# Altium project StepMotor_TMC5160.PrjPcb
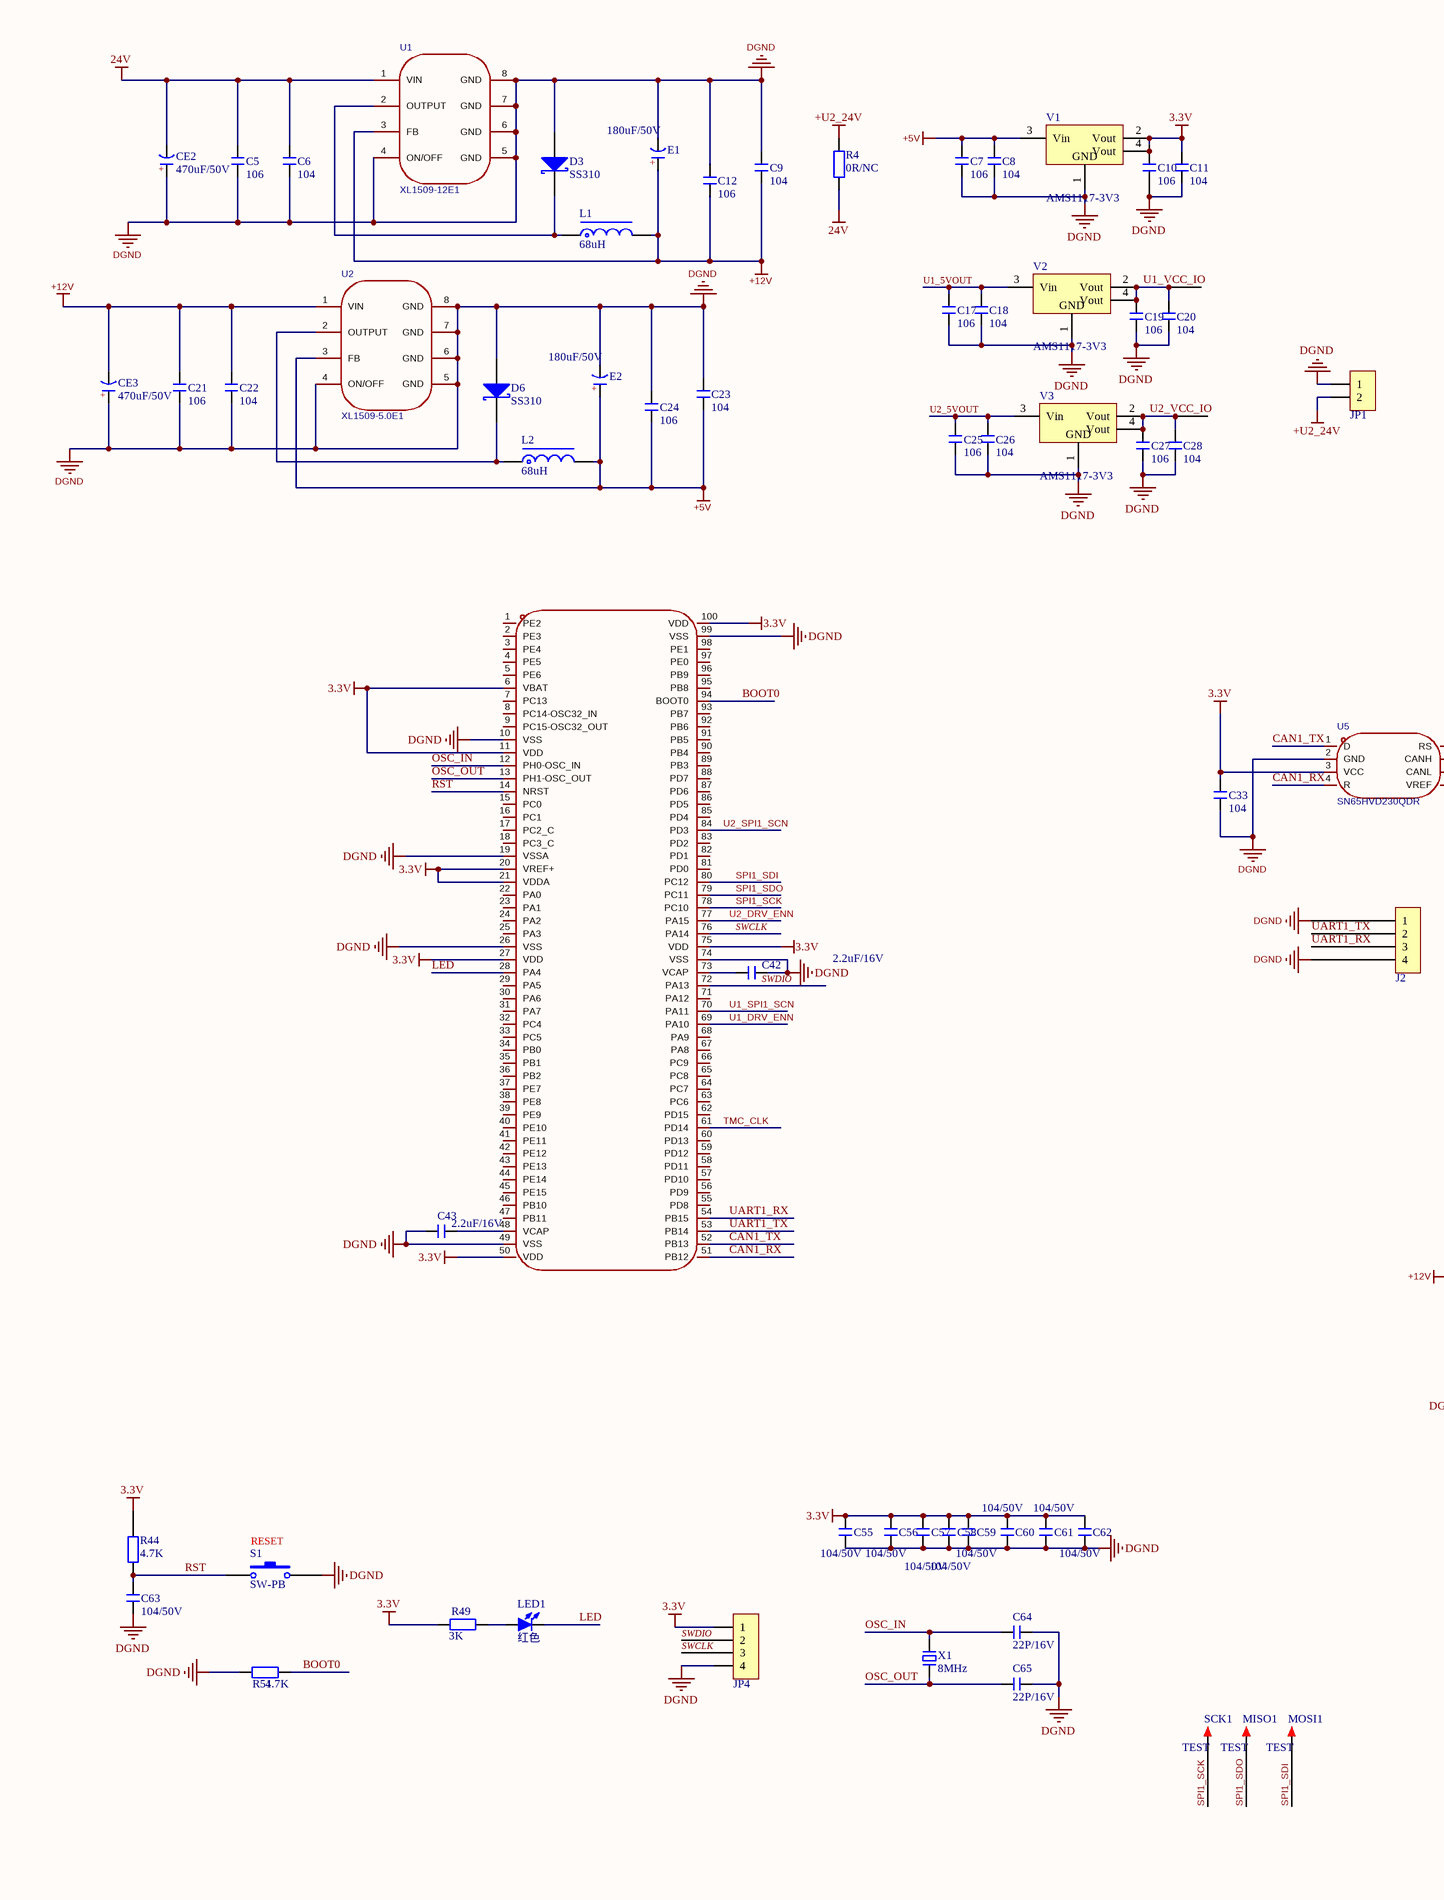
[diagram p0: StepTMC5160.SchDoc, left]
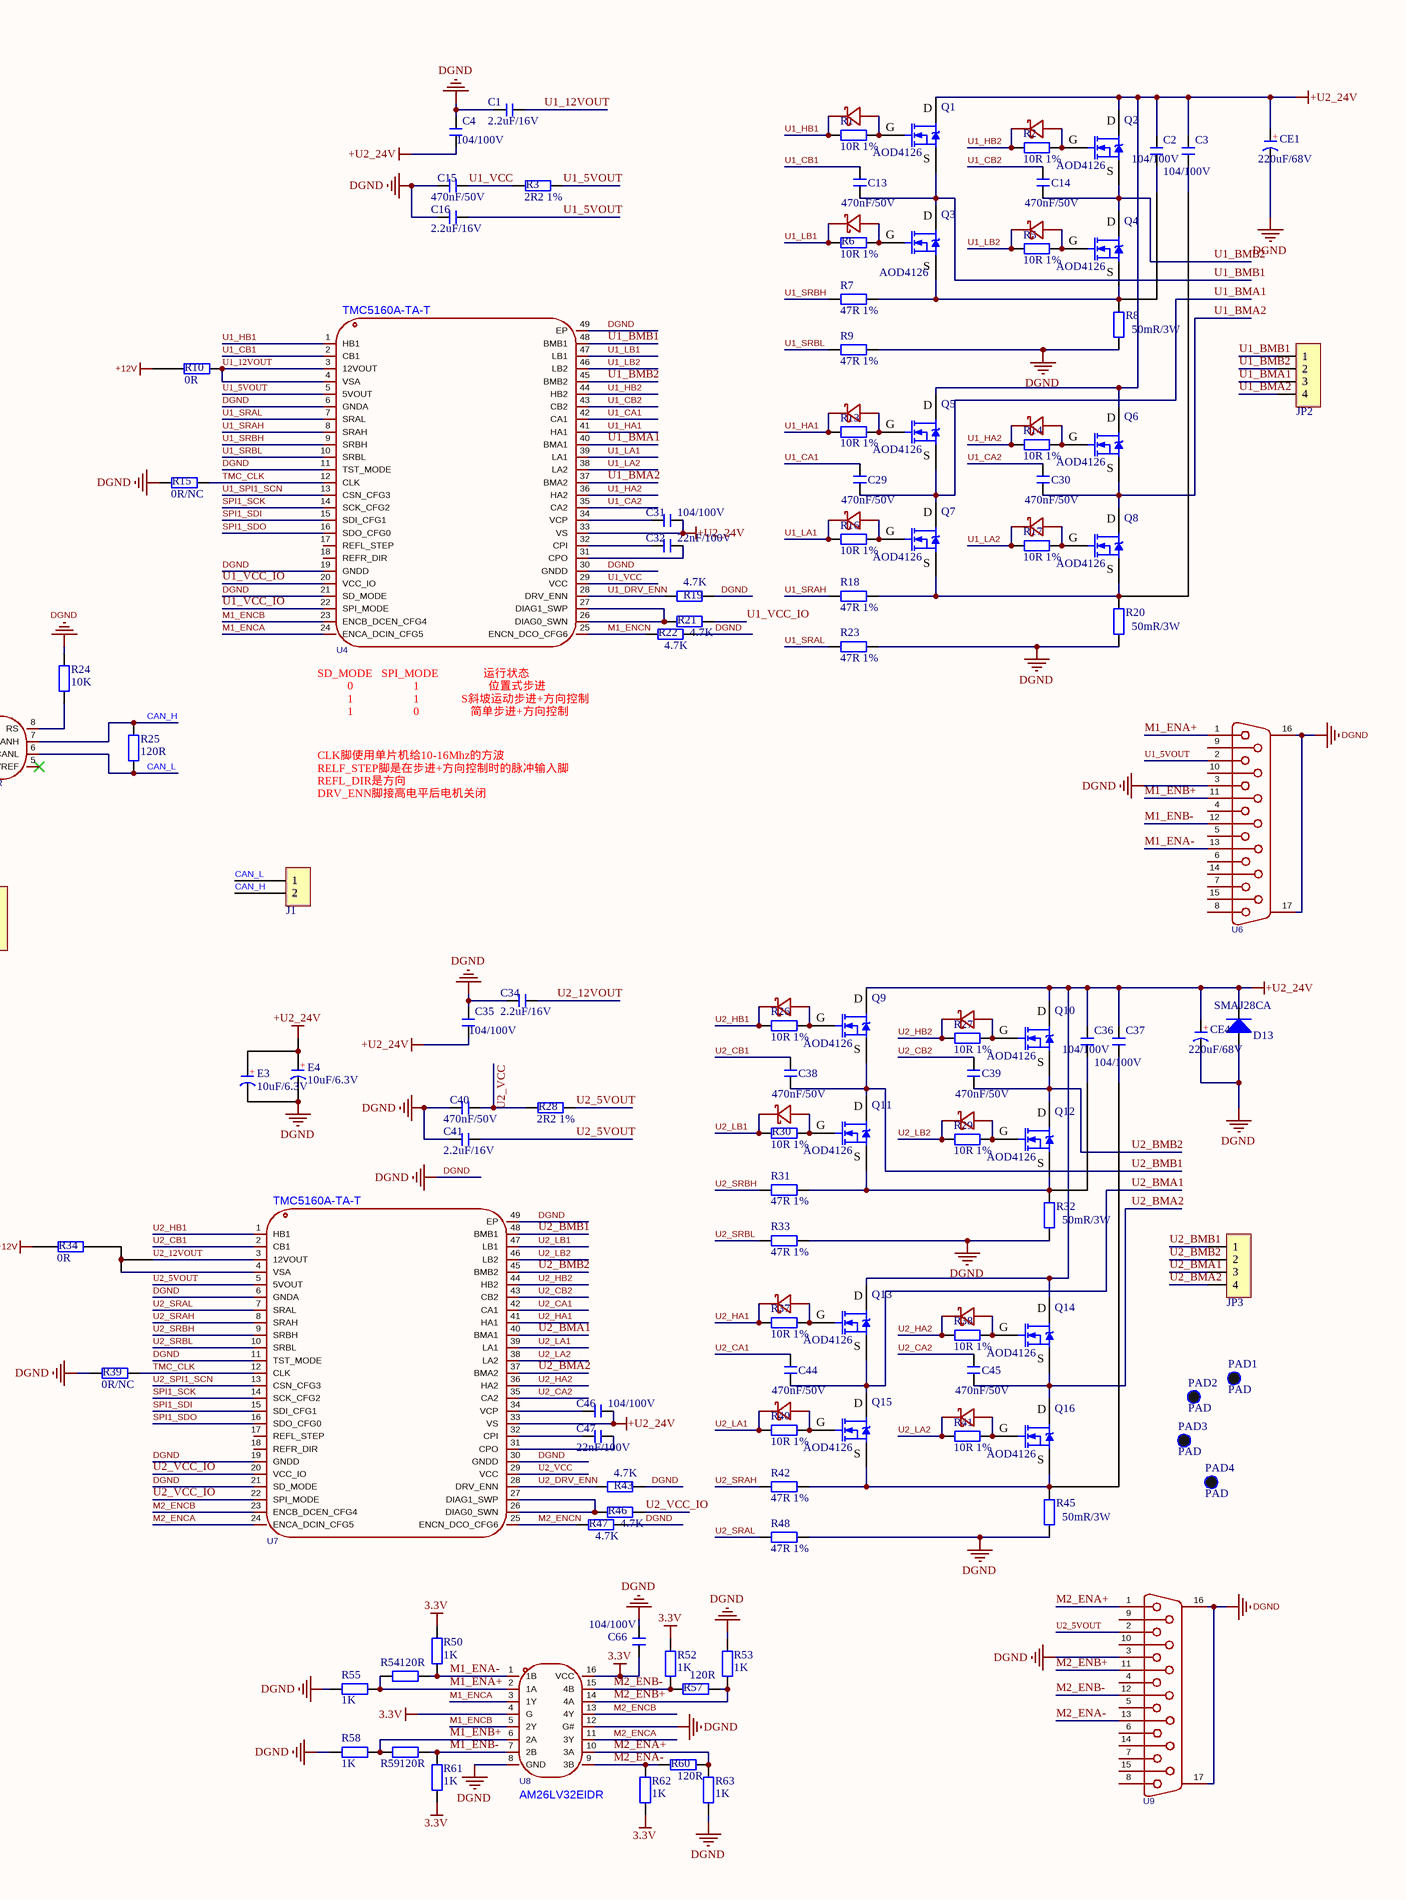
[diagram p1: StepTMC5160.SchDoc, right]
1 sheet, 190 parts. Net scope: global (net labels, ports and power ports of the same name join across sheets).
Board file: StepTMC5160.PcbDoc

## Sheet StepTMC5160.SchDoc
size A2; SheetNumber: 1; SheetTotal: 1

### Parts
C1  2.2uF/16V  [C 0603_L]
C2  104/100V  [C 0805_L]
C3  104/100V  [C 0805_L]
C4  104/100V  [C 0805_L]
C5  106  [C 0805_M]
C6  104  [C 0603_M]
C7  106  [C 0805_M]
C8  104  [C 0603_M]
C9  104  [C 0603_M]
C10  106  [C 0805_M]
C11  104  [C 0603_M]
C12  106  [C 0805_M]
C13  470nF/50V  [C 0805_L]
C14  470nF/50V  [C 0805_L]
C15  470nF/50V  [C 0603_L]
C16  2.2uF/16V  [C 0603_L]
C17  106  [C 0805_M]
C18  104  [C 0603_M]
C19  106  [C 0805_M]
C20  104  [C 0603_M]
C21  106  [C 0805_M]
C22  104  [C 0603_M]
C23  104  [C 0603_M]
C24  106  [C 0805_M]
C25  106  [C 0805_M]
C26  104  [C 0603_M]
C27  106  [C 0805_M]
C28  104  [C 0603_M]
C29  470nF/50V  [C 0805_L]
C30  470nF/50V  [C 0805_L]
C31  104/100V  [C 0805_L]
C32  22nF/100V  [C 0603_L]
C33  104  [C 0603_L]
C34  2.2uF/16V  [C 0603_L]
C35  104/100V  [C 0805_L]
C36  104/100V  [C 0805_L]
C37  104/100V  [C 0805_L]
C38  470nF/50V  [C 0805_L]
C39  470nF/50V  [C 0805_L]
C40  470nF/50V  [C 0603_L]
C41  2.2uF/16V  [C 0603_L]
C42  2.2uF/16V  [C 0603_L]
C43  2.2uF/16V  [C 0603_L]
C44  470nF/50V  [C 0805_L]
C45  470nF/50V  [C 0805_L]
C46  104/100V  [C 0805_L]
C47  22nF/100V  [C 0603_L]
C55  104/50V  [C 0603_L]
C56  104/50V  [C 0603_L]
C57  104/50V  [C 0603_L]
C58  104/50V  [C 0603_L]
C59  104/50V  [C 0603_L]
C60  104/50V  [C 0603_L]
C61  104/50V  [C 0603_L]
C62  104/50V  [C 0603_L]
C63  104/50V  [C 0603_L]
C64  22P/16V  [C 0603_M]
C65  22P/16V  [C 0603_M]
C66  104/100V  [C 0805_L]
CE1  220uF/68V  [CAP 5.0*10*12.5 - BK]
CE2  470uF/50V  [CAP 5.0*10*20]
CE3  470uF/50V  [CAP 5.0*10*20]
CE4  220uF/68V  [CAP 5.0*10*12.5 - BK]
D1  1N4148W_C7420318  [SOD-123]  (value not drawn)
D2  1N4148W_C7420318  [SOD-123]  (value not drawn)
D3  SS310  [SMA]
D4  1N4148W_C7420318  [SOD-123]  (value not drawn)
D5  1N4148W_C7420318  [SOD-123]  (value not drawn)
D6  SS310  [SMA]
D7  1N4148W_C7420318  [SOD-123]  (value not drawn)
D8  1N4148W_C7420318  [SOD-123]  (value not drawn)
D9  1N4148W_C7420318  [SOD-123]  (value not drawn)
D10  1N4148W_C7420318  [SOD-123]  (value not drawn)
D11  1N4148W_C7420318  [SOD-123]  (value not drawn)
D12  1N4148W_C7420318  [SOD-123]  (value not drawn)
D13  SMAJ28CA  [DIODE-SMB]
D14  1N4148W_C7420318  [SOD-123]  (value not drawn)
D15  1N4148W_C7420318  [SOD-123]  (value not drawn)
D16  1N4148W_C7420318  [SOD-123]  (value not drawn)
D17  1N4148W_C7420318  [SOD-123]  (value not drawn)
D18  1N4148W_C7420318  [SOD-123]  (value not drawn)
D19  1N4148W_C7420318  [SOD-123]  (value not drawn)
E1  180uF/50V  [CM E(8*10.2)]
E2  180uF/50V  [CM E(8*10.2)]
E3  10uF/6.3V  [CD A(3216)]
E4  10uF/6.3V  [CD A(3216)]
J1  HDR-1X2  [XH2.54-LI-2P]  (value not drawn)
J2  HDR-1X4  [HDR2.54-LI-4P]  (value not drawn)
JP1  HDR-1X2  [VH3.96-LI-2P]  (value not drawn)
JP2  HDR-1X4  [KF2EDGK5.0-LI-4P]  (value not drawn)
JP3  HDR-1X4  [KF2EDGK5.0-LI-4P]  (value not drawn)
JP4  HDR-1X4  [HDR2.54-LI-4P]  (value not drawn)
L1  68uH  [IND-SMD_L5.7-W5.2_GSM0530]
L2  68uH  [IND-SMD_L5.7-W5.2_GSM0530]
LED1  红色  [LED 0805G]
MISO1  TEST  [TEST 1.6]
MOSI1  TEST  [TEST 1.6]
PAD1  PAD  [PAD_3.0]
PAD2  PAD  [PAD_3.0]
PAD3  PAD  [PAD_3.0]
PAD4  PAD  [PAD_3.0]
Q1  AOD4126  [TO252]
Q2  AOD4126  [TO252]
Q3  AOD4126  [TO252]
Q4  AOD4126  [TO252]
Q5  AOD4126  [TO252]
Q6  AOD4126  [TO252]
Q7  AOD4126  [TO252]
Q8  AOD4126  [TO252]
Q9  AOD4126  [TO252]
Q10  AOD4126  [TO252]
Q11  AOD4126  [TO252]
Q12  AOD4126  [TO252]
Q13  AOD4126  [TO252]
Q14  AOD4126  [TO252]
Q15  AOD4126  [TO252]
Q16  AOD4126  [TO252]
R1  10R 1%  [R 0603_L]
R2  10R 1%  [R 0603_L]
R3  2R2 1%  [R 0603_L]
R4  0R/NC  [R 0805_L]
R5  10R 1%  [R 0603_L]
R6  10R 1%  [R 0603_L]
R7  47R 1%  [R 0603_L]
R8  50mR/3W  [R 2512_L]
R9  47R 1%  [R 0603_L]
R10  0R  [R 0603_L]
R13  10R 1%  [R 0603_L]
R14  10R 1%  [R 0603_L]
R15  0R/NC  [R 0603_L]
R16  10R 1%  [R 0603_L]
R17  10R 1%  [R 0603_L]
R18  47R 1%  [R 0603_L]
R19  4.7K  [R 0603_L]
R20  50mR/3W  [R 2512_L]
R21  4.7K  [R 0603_L]
R22  4.7K  [R 0603_L]
R23  47R 1%  [R 0603_L]
R24  10K  [R 0603_L]
R25  120R  [R 0603_L]
R26  10R 1%  [R 0603_L]
R27  10R 1%  [R 0603_L]
R28  2R2 1%  [R 0603_L]
R29  10R 1%  [R 0603_L]
R30  10R 1%  [R 0603_L]
R31  47R 1%  [R 0603_L]
R32  50mR/3W  [R 2512_L]
R33  47R 1%  [R 0603_L]
R34  0R  [R 0603_L]
R37  10R 1%  [R 0603_L]
R38  10R 1%  [R 0603_L]
R39  0R/NC  [R 0603_L]
R40  10R 1%  [R 0603_L]
R41  10R 1%  [R 0603_L]
R42  47R 1%  [R 0603_L]
R43  4.7K  [R 0603_L]
R44  4.7K  [R 0603_L]
R45  50mR/3W  [R 2512_L]
R46  4.7K  [R 0603_L]
R47  4.7K  [R 0603_L]
R48  47R 1%  [R 0603_L]
R49  3K  [R 0603_L]
R50  1K  [R 0603_L]
R51  4.7K  [R 0603_L]
R52  1K  [R 0603_L]
R53  1K  [R 0603_L]
R54  120R  [R 0603_L]
R55  1K  [R 0603_L]
R57  120R  [R 0603_L]
R58  1K  [R 0603_L]
R59  120R  [R 0603_L]
R60  120R  [R 0603_L]
R61  1K  [R 0603_L]
R62  1K  [R 0603_L]
R63  1K  [R 0603_L]
S1  SW-PB  [SW_PB2_A1]
SCK1  TEST  [TEST 1.6]
U1  XL1509-12E1  [SOIC-8_L5.0-W4.0-P1.27-LS6.0-BL]
U2  XL1509-5.0E1  [SOIC-8_L5.0-W4.0-P1.27-LS6.0-BL]
U3  stm32h750vbt6  [LQFP-100_L14.0-W14.0-P0.50-LS16.0-BL]  (value not drawn)
U4  TMC5160A-TA-T  [TQFP-48_L7.0-W7.0-P0.50-LS9.0-BL-EP]
U5  SN65HVD230QDR  [SOIC-8_L5.0-W4.0-P1.27-LS6.0-BL]
U6  XDDB-1518-0932  [DDSUB-TH_HYC06-HDR15B-060]  (value not drawn)
U7  TMC5160A-TA-T  [TQFP-48_L7.0-W7.0-P0.50-LS9.0-BL-EP]
U8  AM26LV32EIDR  [SOIC-16_L9.9-W3.9-P1.27-LS6.0-BL]
U9  XDDB-1518-0932  [DDSUB-TH_HYC06-HDR15B-060]  (value not drawn)
V1  AMS1117-3V3  [SOT223_L]
V2  AMS1117-3V3  [SOT223_L]
V3  AMS1117-3V3  [SOT223_L]
X1  8MHz  [OSC 6035-2P]

### Nets
3.3V: C10.2 C11.2 C33.2 C55.2 C56.2 C57.2 C58.2 C59.2 C60.2 C61.2 C62.2 C66.2 JP4.1 R44.2 R49.2 R50.2 R52.2 R61.2 R62.2 U3.6(VBAT) U3.11(VDD) U3.20(VREF+) U3.21(VDDA) U3.27(VDD) U3.50(VDD) U3.75(VDD) U3.100(VDD) U5.3(VCC) U8.4(G) U8.16(VCC) V1.2(Vout) V1.4(Vout)
24V: C5.2 C6.2 CE2.2(K) R4.1 U1.1(VIN)
+5V: C7.2 C8.2 C23.1 C24.1 E2.1(A) L2.2 U2.3(FB) V1.3(Vin)
+12V: C9.1 C12.1 C21.2 C22.2 CE3.2(K) E1.1(A) L1.2 R10.2 R34.2 U1.3(FB) U2.1(VIN)
+U2_24V: C2.2 C3.2 C4.2 C31.2 C35.2 C36.2 C37.2 C46.2 CE1.1(A) CE4.1(A) D13.2(K) E3.1(A) E4.1(A) JP1.2 Q1.2(D) Q2.2(D) Q5.2(D) Q6.2(D) Q9.2(D) Q10.2(D) Q13.2(D) Q14.2(D) R4.2 U4.33(VS) U7.33(VS)
DGND: C1.1 C4.1 C5.1 C6.1 C7.1 C8.1 C9.2 C10.1 C11.1 C12.2 C15.1 C16.1 C17.1 C18.1 C19.1 C20.1 C21.1 C22.1 C23.2 C24.2 C25.1 C26.1 C27.1 C28.1 C33.1 C34.1 C35.1 C40.1 C41.1 C42.2 C43.2 C55.1 C56.1 C57.1 C58.1 C59.1 C60.1 C61.1 C62.1 C63.1 C64.1 C65.1 C66.1 CE1.2(K) CE2.1(A) CE3.1(A) CE4.2(K) D3.1(A) D6.1(A) D13.1(A) E1.2(K) E2.2(K) E3.2(K) E4.2(K) J2.1 J2.4 JP1.1 JP4.4 R8.1 R9.2 R15.2 R19.2 R20.1 R22.2 R23.2 R24.2 R32.1 R33.2 R39.2 R43.2 R45.1 R47.2 R48.2 R51.1 R53.1 R55.1 R58.1 R63.1 S1.2 U1.4(ON/OFF) U1.5(GND) U1.6(GND) U1.7(GND) U1.8(GND) U2.4(ON/OFF) U2.5(GND) U2.6(GND) U2.7(GND) U2.8(GND) U3.10(VSS) U3.19(VSSA) U3.26(VSS) U3.49(VSS) U3.74(VSS) U3.99(VSS) U4.6(GNDA) U4.11(TST_MODE) U4.19(GNDD) U4.21(SD_MODE) U4.30(GNDD) U4.49(EP) U5.2(GND) U6.3 U6.16(MH2) U6.17(MH1) U7.6(GNDA) U7.11(TST_MODE) U7.19(GNDD) U7.21(SD_MODE) U7.30(GNDD) U7.49(EP) U8.8(GND) U8.12(G#) U9.3 U9.16(MH2) U9.17(MH1) V1.1(GND) V2.1(GND) V3.1(GND)
BOOT0: R51.2 U3.94(BOOT0)
CAN1_RX: U3.51(PB12) U5.4(R)
CAN1_TX: U3.52(PB13) U5.1(D)
CAN_H: J1.2 R25.2 U5.7(CANH)
CAN_L: J1.1 R25.1 U5.6(CANL)
LED: LED1.2(K) U3.28(PA4)
M1_ENA+: R54.2 R55.2 U6.1 U8.2(1A)
M1_ENA-: R50.1 R54.1 U6.13 U8.1(1B)
M1_ENB+: R58.2 R59.2 U6.11 U8.6(2A)
M1_ENB-: R59.1 R61.1 U6.12 U8.7(2B)
M1_ENCA: U4.24(ENCA_DCIN_CFG5) U8.3(1Y)
M1_ENCB: U4.23(ENCB_DCEN_CFG4) U8.5(2Y)
M1_ENCN: R22.1 U4.25(ENCN_DCO_CFG6)
M2_ENA+: R60.2 R63.2 U8.10(3A) U9.1
M2_ENA-: R60.1 R62.1 U8.9(3B) U9.13
M2_ENB+: R53.2 R57.1 U8.14(4A) U9.11
M2_ENB-: R52.1 R57.2 U8.15(4B) U9.12
M2_ENCA: U7.24(ENCA_DCIN_CFG5) U8.11(3Y)
M2_ENCB: U7.23(ENCB_DCEN_CFG4) U8.13(4Y)
M2_ENCN: R47.1 U7.25(ENCN_DCO_CFG6)
OSC_IN: C64.2 U3.12(PH0-OSC_IN) X1.2
OSC_OUT: C65.2 U3.13(PH1-OSC_OUT) X1.1
RST: C63.2 R44.1 S1.1 U3.14(NRST)
SPI1_SCK: SCK1.1 U3.78(PC10) U4.14(SCK_CFG2) U7.14(SCK_CFG2)
SPI1_SDI: MOSI1.1 U3.80(PC12) U4.15(SDI_CFG1) U7.15(SDI_CFG1)
SPI1_SDO: MISO1.1 U3.79(PC11) U4.16(SDO_CFG0) U7.16(SDO_CFG0)
SWCLK: JP4.3 U3.76(PA14)
SWDIO: JP4.2 U3.72(PA13)
TMC_CLK: R15.1 R39.1 U3.61(PD14) U4.12(CLK) U7.12(CLK)
U1_5VOUT: C16.2 C17.2 C18.2 R3.1 U4.5(5VOUT) U6.2 V2.3(Vin)
U1_12VOUT: C1.2 R10.1 U4.3(12VOUT) U4.4(VSA)
U1_BMA1: C29.1 JP2.3 Q5.3(S) Q7.2(D) U4.40(BMA1)
U1_BMA2: C30.1 JP2.4 Q6.3(S) Q8.2(D) U4.37(BMA2)
U1_BMB1: C13.1 JP2.1 Q1.3(S) Q3.2(D) U4.48(BMB1)
U1_BMB2: C14.1 JP2.2 Q2.3(S) Q4.2(D) U4.45(BMB2)
U1_CA1: C29.2 U4.42(CA1)
U1_CA2: C30.2 U4.35(CA2)
U1_CB1: C13.2 U4.2(CB1)
U1_CB2: C14.2 U4.43(CB2)
U1_DRV_ENN: R19.1 U3.69(PA10) U4.28(DRV_ENN)
U1_HA1: D7.2(K) R13.1 U4.41(HA1)
U1_HA2: D8.2(K) R14.1 U4.36(HA2)
U1_HB1: D1.2(K) R1.1 U4.1(HB1)
U1_HB2: D2.2(K) R2.1 U4.44(HB2)
U1_LA1: D9.2(K) R16.1 U4.39(LA1)
U1_LA2: D10.2(K) R17.1 U4.38(LA2)
U1_LB1: D4.2(K) R6.1 U4.47(LB1)
U1_LB2: D5.2(K) R5.1 U4.46(LB2)
U1_SPI1_SCN: U3.70(PA11) U4.13(CSN_CFG3)
U1_SRAH: R18.1 U4.8(SRAH)
U1_SRAL: R23.1 U4.7(SRAL)
U1_SRBH: R7.1 U4.9(SRBH)
U1_SRBL: R9.1 U4.10(SRBL)
U1_VCC: C15.2 R3.2 U4.29(VCC)
U1_VCC_IO: C19.2 C20.2 R21.2 U4.20(VCC_IO) U4.22(SPI_MODE) V2.2(Vout) V2.4(Vout)
U2_5VOUT: C25.2 C26.2 C41.2 R28.1 U7.5(5VOUT) U9.2 V3.3(Vin)
U2_12VOUT: C34.2 R34.1 U7.3(12VOUT) U7.4(VSA)
U2_BMA1: C44.1 JP3.3 Q13.3(S) Q15.2(D) U7.40(BMA1)
U2_BMA2: C45.1 JP3.4 Q14.3(S) Q16.2(D) U7.37(BMA2)
U2_BMB1: C38.1 JP3.1 Q9.3(S) Q11.2(D) U7.48(BMB1)
U2_BMB2: C39.1 JP3.2 Q10.3(S) Q12.2(D) U7.45(BMB2)
U2_CA1: C44.2 U7.42(CA1)
U2_CA2: C45.2 U7.35(CA2)
U2_CB1: C38.2 U7.2(CB1)
U2_CB2: C39.2 U7.43(CB2)
U2_DRV_ENN: R43.1 U3.77(PA15) U7.28(DRV_ENN)
U2_HA1: D16.2(K) R37.1 U7.41(HA1)
U2_HA2: D17.2(K) R38.1 U7.36(HA2)
U2_HB1: D11.2(K) R26.1 U7.1(HB1)
U2_HB2: D12.2(K) R27.1 U7.44(HB2)
U2_LA1: D18.2(K) R40.1 U7.39(LA1)
U2_LA2: D19.2(K) R41.1 U7.38(LA2)
U2_LB1: D14.2(K) R30.1 U7.47(LB1)
U2_LB2: D15.2(K) R29.1 U7.46(LB2)
U2_SPI1_SCN: U3.84(PD3) U7.13(CSN_CFG3)
U2_SRAH: R42.1 U7.8(SRAH)
U2_SRAL: R48.1 U7.7(SRAL)
U2_SRBH: R31.1 U7.9(SRBH)
U2_SRBL: R33.1 U7.10(SRBL)
U2_VCC: C40.2 R28.2 U7.29(VCC)
U2_VCC_IO: C27.2 C28.2 R46.2 U7.20(VCC_IO) U7.22(SPI_MODE) V3.2(Vout) V3.4(Vout)
UART1_RX: J2.3 U3.54(PB15)
UART1_TX: J2.2 U3.53(PB14)
NetC2_1: C2.1 Q3.3(S) Q4.3(S) R7.2 R8.2
NetC3_1: C3.1 Q7.3(S) Q8.3(S) R18.2 R20.2
NetC31_1: C31.1 U4.34(VCP)
NetC32_1: C32.1 U4.32(CPI)
NetC32_2: C32.2 U4.31(CPO)
NetC36_1: C36.1 Q11.3(S) Q12.3(S) R31.2 R32.2
NetC37_1: C37.1 Q15.3(S) Q16.3(S) R42.2 R45.2
NetC42_1: C42.1 U3.73(VCAP)
NetC43_1: C43.1 U3.48(VCAP)
NetC46_1: C46.1 U7.34(VCP)
NetC47_1: C47.1 U7.32(CPI)
NetC47_2: C47.2 U7.31(CPO)
NetD1_1: D1.1(A) Q1.1(G) R1.2
NetD2_1: D2.1(A) Q2.1(G) R2.2
NetD3_2: D3.2(K) L1.1 U1.2(OUTPUT)
NetD4_1: D4.1(A) Q3.1(G) R6.2
NetD5_1: D5.1(A) Q4.1(G) R5.2
NetD6_2: D6.2(K) L2.1 U2.2(OUTPUT)
NetD7_1: D7.1(A) Q5.1(G) R13.2
NetD8_1: D8.1(A) Q6.1(G) R14.2
NetD9_1: D9.1(A) Q7.1(G) R16.2
NetD10_1: D10.1(A) Q8.1(G) R17.2
NetD11_1: D11.1(A) Q9.1(G) R26.2
NetD12_1: D12.1(A) Q10.1(G) R27.2
NetD14_1: D14.1(A) Q11.1(G) R30.2
NetD15_1: D15.1(A) Q12.1(G) R29.2
NetD16_1: D16.1(A) Q13.1(G) R37.2
NetD17_1: D17.1(A) Q14.1(G) R38.2
NetD18_1: D18.1(A) Q15.1(G) R40.2
NetD19_1: D19.1(A) Q16.1(G) R41.2
NetLED1_1: LED1.1(A) R49.1
NetR21_1: R21.1 U4.26(DIAG0_SWN) U4.27(DIAG1_SWP)
NetR24_1: R24.1 U5.8(RS)
NetR46_1: R46.1 U7.26(DIAG0_SWN) U7.27(DIAG1_SWP)

Not connected (* = marked no-connect by the designer): U3 1(PE2) 2(PE3) 3(PE4) 4(PE5) 5(PE6) 7(PC13) 8(PC14-OSC32_IN) 9(PC15-OSC32_OUT) 15(PC0) 16(PC1) 17(PC2_C) 18(PC3_C) 22(PA0) 23(PA1) 24(PA2) 25(PA3) 29(PA5) 30(PA6) 31(PA7) 32(PC4) 33(PC5) 34(PB0) 35(PB1) 36(PB2) 37(PE7) 38(PE8) 39(PE9) 40(PE10) 41(PE11) 42(PE12) 43(PE13) 44(PE14) 45(PE15) 46(PB10) 47(PB11) 55(PD8) 56(PD9) 57(PD10) 58(PD11) 59(PD12) 60(PD13) 62(PD15) 63(PC6) 64(PC7) 65(PC8) 66(PC9) 67(PA8) 68(PA9) 71(PA12) 81(PD0) 82(PD1) 83(PD2) 85(PD4) 86(PD5) 87(PD6) 88(PD7) 89(PB3) 90(PB4) 91(PB5) 92(PB6) 93(PB7) 95(PB8) 96(PB9) 97(PE0) 98(PE1); U4 17(REFL_STEP) 18(REFR_DIR); U5 5(VREF)*; U6 4 5 6 7 8 9 10 14 15; U7 17(REFL_STEP) 18(REFR_DIR); U9 4 5 6 7 8 9 10 14 15

### Notes on the sheet
- (near U4) SD_MODE   SPI_MODE               运行状态
  0                    1                       位置式步进
  1                    1              S斜坡运动步进+方向控制
  1                    0                 简单步进+方向控制
- CLK脚使用单片机给10-16Mhz的方波
  RELF_STEP脚是在步进+方向控制时的脉冲输入脚
  REFL_DIR是方向
  DRV_ENN脚接高电平后电机关闭
- (near S1) RESET
- (in symbol CE) +
- (in symbol CE_SMD) +
- (in symbol CT) +

### Library data of the parts
C1-C47 C55-C66 = C: 贴片电容; BOM名称: 无极性贴片电容; 淘宝ID: 封装库来自淘宝 ID：黄晶宝石; 联系售后，技术支持: https://shop463601444.taobao.com; 唯一出售店铺网址: https://shop463601444.taobao.com
CE1-CE4 = CE: 直插电解电容; 淘宝ID: 封装库来自淘宝 ID：黄晶宝石; BOM名称: 直插电解电容; 联系售后: https://shop463601444.taobao.com
D3 D6 = SS34: 肖特基二极管; 属性: 40V/3A; BOM名称: 肖特基二极管; 封装库来自淘宝 ID：黄晶宝石: https://shop463601444.taobao.com
D13 = TVS: TVS保护; Type: E6.8CA; Published: 8-Jun-2000; LatestRevisionDate: 17-Jul-2002; LatestRevisionNote: Re-released for DXP Platform.; PackageDocument: Sep-1996; PackageReference: SMC; Publisher: Altium Limited; Code_JEDEC: DO-214-AB
E1 E2 = CE_SMD: 贴片电解电容; 版权归属: 封装库来自淘宝 ID：黄晶宝石; BOM名称: 贴片电解电容; 联系售后: https://shop463601444.taobao.com
E3 E4 = CT: 贴片钽电容; 淘宝ID: 封装库来自淘宝 ID：黄晶宝石; BOM名称: 贴片钽电容; 联系售后: https://shop463601444.taobao.com
J1 = Header 2: 2P接插件; 版权归属: 封装库来自淘宝 ID：黄晶宝石; BOM名称: 2P接插件; 联系售后: https://shop463601444.taobao.com
J2 JP4 = Header 4: 4P接插件; 版权归属: 封装库来自淘宝 ID：黄晶宝石; BOM名称: 4P接插件; 学习资源: https://shop463601444.taobao.com
JP1 = Header 2: 2P接插件; 版权归属: 封装库来自淘宝卖家 ID：黄晶宝石; BOM名称: 2P接插件; 学习资源: https://shop463601444.taobao.com
JP2 JP3 = Header 4: 4P接插件; 版权归属: 源创客; BOM名称: 4P接插件; 学习资源: www.ooocke.com
L1 L2 = L-CDRH: 功率屏蔽电感; 版权归属: 封装库来自淘宝 ID：黄晶宝石; BOM名称: 功率屏蔽电感; 联系售后: https://shop463601444.taobao.com
LED1 = LED-SMD: 贴片LED; 版权归属: 封装库来自淘宝 ID：黄晶宝石; BOM名称: 贴片LED; 学习资源: https://shop463601444.taobao.com
MISO1 MOSI1 SCK1 = TEST: 测试点; 版权归属: 封装库来自淘宝 ID：黄晶宝石; BOM名称: 测试点; 学习资源: https://shop463601444.taobao.com
PAD1-PAD4 = PAD: 固定用途的焊盘
Q1-Q16 = 2SK3615: N沟场效应管; 技术支持，联系售后: 其他店铺购入均为盗版，不享受售后技术支持服务，请立即申请退款; BOM名称: N沟场效应管; 学习资源: https://shop463601444.taobao.com
R1-R10 R13-R34 R37-R55 R57-R63 = R: 贴片电阻; 版权归属: 来自淘宝 ID：黄晶宝石; 封装库来自淘宝卖家 ID：黄晶宝石: 其他店铺购入均为盗版，不享受售后技术支持服务，请立即申请退款; BOM名称: 贴片电阻; 联系售后: https://shop463601444.taobao.com
S1 = SW-PB: 微动开关; Published: 24-Mar-1999; LatestRevisionDate: 17-Jul-2002; LatestRevisionNote: Re-released for DXP Platform.; PackageReference: SPST-2; Publisher: Altium Limited
U1 U2 = XL1509-5.0E1: 功能类型:降压型;工作电压:4.5V~40V;输出电压:5V;输出电流:2A;输出类型:固定;; Manufacturer: XLSEMI(芯龙); AddInBom: yes; ModelId: 7abc64c95a1a4a04a4ef38f9097c870b聨0819f05c4eef4c71ace90d822a990e87; ModelTransform: 192.913,236.22,0,0,0,0,0,0,0; Function: 降压型; Output Voltage: 5V; Output Current: 2A; Frequency - Switching: 150kHz; Synchronous Rectifier: 否; Number of Outputs: 1; Topology: 降压式; Quiescent Current: 2mA; Switch tube (built-in/external): 内置; Output Type: 固定; Symbol: XL1509-5.0E1; Device: XL1509-5.0E1; LCSC Part Name: 2A 150KHz 40V 降压 DC-DC 转换器; SupplierPart: C61063; ManufacturerPart: XL1509-5.0E1; Supplier Footprint: SOIC-8; JLCPCB Part Class: Basic Part; Datasheet: https://item.szlcsc.com/datasheet/XL1509-5.0E1/62115.html; Supplier: LCSC; ConvertToPcb: yes; FootprintName: SOIC-8_L5.0-W4.0-P1.27-LS6.0-BL; ModelName: SOIC-8_L5.0-W4.0-P1.27-LS6.0-BL; Voltage - Supply: 4.5V~40V; Operating Temperature: -40℃~+85℃
U3 = stm32h750vbt6_1: CPU内核:ARM Cortex-M7;CPU最大主频:480MHz;CPU位数:32 Bit;; Manufacturer: ST(意法半导体); AddInBom: yes; ModelId: 469e6cc70557486dbd01fd12ff814964; ModelName: LQFP-100_L14.0-W14.0-H1.4-LS16.0-P0.50; ModelTransform: 629.92,629.92,0,0,0,0,0,0,0; CPU Maximum Speed: 480MHz; Core Size: 32 Bit; Program Storage Size: 128KB; Program Memory Type: FLASH; RAM Size: 1MB; Number of I/O: 82; ADC (Bit): 16bit; DAC (Bit): 12bit; Oscillator Type: 内置; Voltage - Supply: 1.62V~3.6V; Symbol: STM32H750VBT6; LCSC Part Name: 带DSP和DP-FPU的高性能ARM Cortex-M7 MCU，具有128 KB Flash、1 MB RAM、480 MHz CPU、一级缓存、外部存储器接口、JPEG编解码器、硬件加密和大量外设; SupplierPart: C404010; ManufacturerPart: STM32H750VBT6; Supplier Footprint: LQFP-100(14x14); JLCPCB Part Class: Extended Part; Datasheet: https://item.szlcsc.com/datasheet/STM32H750VBT6/391001.html; Supplier: LCSC; ConvertToPcb: yes; FootprintName: LQFP-100_L14.0-W14.0-P0.50-LS16.0-BL; CPU Core: ARM Cortex-M7; EEPROM: -; Operating Temperature: -40℃~+85℃
U5 = SN65HVD230QDR: 类型:CAN收发器;数据速率:1Mbps;; Manufacturer: TI(德州仪器); 3D Model: 7abc64c95a1a4a04a4ef38f9097c870b聨0819f05c4eef4c71ace90d822a990e87; 3D Model Transform: 192.913,236.22,0,0,0,0,0,0,0; Data Rate: 1Mbps; Voltage - Supply: 3V~3.6V; Current - Supply: 17mA; Quiescent Supply Current: 370uA; AddInBom: yes; Symbol: SN65HVD230QDR; Device: SN65HVD230QDR; LCSC Part Name: SN65HVD230Q-Q1 CAN收发器; Supplier Part: C16468; Manufacturer Part: SN65HVD230QDR; Supplier Footprint: SOIC-8; JLCPCB Part Class: Extended Part; Datasheet: https://www.ti.com/cn/lit/gpn/sn65hvd230q; Supplier: LCSC; Type: CAN收发器; Operating Temperature: -40℃~+125℃; Number of Channels: -; ConvertToPcb: yes; FootprintName: SOIC-8_L5.0-W4.0-P1.27-LS6.0-BL; ModelName: SOIC-8_L5.0-W4.0-P1.27-LS6.0-BL
V1-V3 = AMS1117: 三端稳压芯片; BOM名称: 稳压芯片; 淘宝ID: 封装库来自淘宝 ID：黄晶宝石; 欢迎光临淘宝店铺: https://shop463601444.taobao.com
X1 = XTAL-2P: 2脚无源脚晶振; 版权归属: 封装库来自淘宝卖家 ID：黄晶宝石; BOM名称: 2脚无源脚晶振; 学习资源: https://shop463601444.taobao.com
D1 D2 D4 D5 D7-D12 D14-D19 = 1N4148W_C7420318: Symbol: 1N4148W_C7420318
U4 U7 = TMC5160A-TA-T: Symbol: TMC5160A-TA-T
U6 U9 = XDDB-1518-0932: Symbol: XDDB-1518-0932
U8 = AM26LV32EIDR: Symbol: AM26LV32EIDR